# Altium schematic sheet DSO_CPLD.SchDoc
size A4
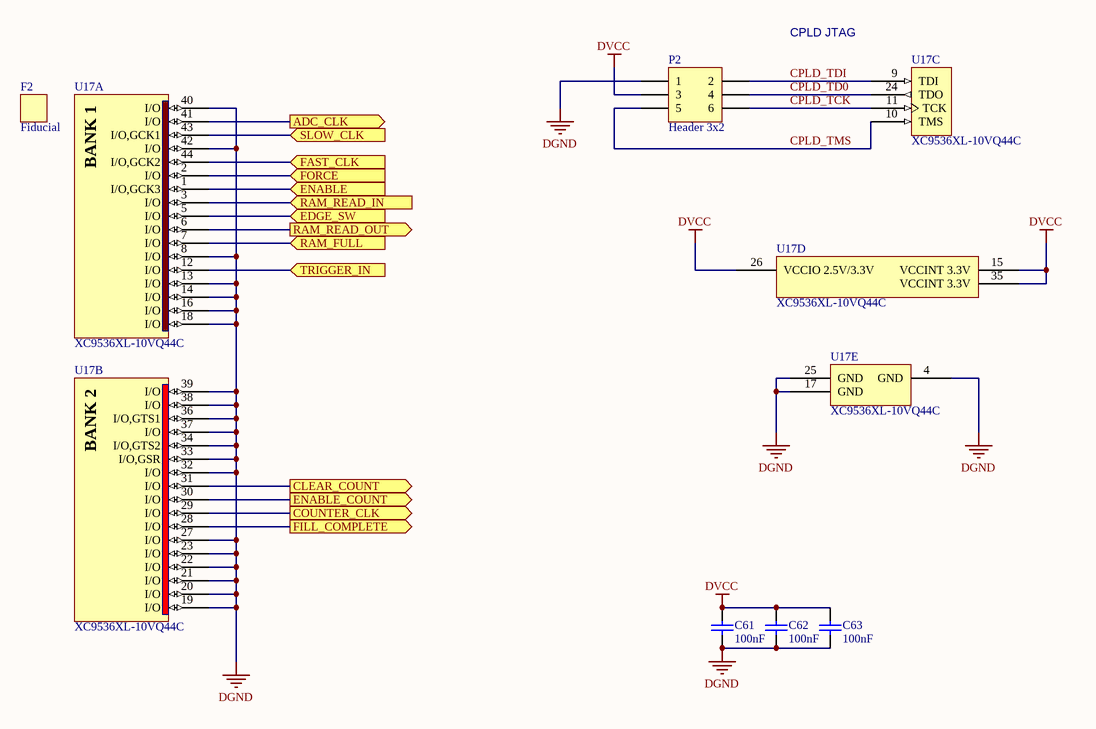
[diagram p0: DSO_CPLD.SchDoc]

## Parts
C61  100nF  [0805C]
C62  100nF  [0805C]
C63  100nF  [0805C]
F2  Fiducial  [FIDUCIAL]  (no BOM)
P2  Header 3x2  [HDR3x2]
U17  XC9536XL-10VQ44C  [VQ44_L]  (parts A,B,C,D,E of 5)

## Ports
ADC_CLK (out), CLEAR_COUNT (out), COUNTER_CLK (out), EDGE_SW (in), ENABLE (in), ENABLE_COUNT (out), FAST_CLK (in), FILL_COMPLETE (out), FORCE (in), RAM_FULL (in), RAM_READ_IN (in), RAM_READ_OUT (out), SLOW_CLK (in), TRIGGER_IN (in)

## Nets
DGND: C61.2 C62.2 C63.2 P2.1 U17.4(GND) U17.8(I/O) U17.13(I/O) U17.14(I/O) U17.16(I/O) U17.17(GND) U17.18(I/O) U17.19(I/O) U17.20(I/O) U17.21(I/O) U17.22(I/O) U17.23(I/O) U17.25(GND) U17.27(I/O) U17.32(I/O) U17.33(I/O,GSR) U17.34(I/O,GTS2) U17.36(I/O,GTS1) U17.37(I/O) U17.38(I/O) U17.39(I/O) U17.40(I/O) U17.42(I/O)
DVCC: C61.1 C62.1 C63.1 P2.3 U17.15(VCCINT_3.3V) U17.26(VCCIO_2.5V/3.3V) U17.35(VCCINT_3.3V)
ADC_CLK: U17.41(I/O) ; port ADC_CLK
CLEAR_COUNT: U17.31(I/O) ; port CLEAR_COUNT
COUNTER_CLK: U17.29(I/O) ; port COUNTER_CLK
CPLD_TCK: P2.6 U17.11(TCK)
CPLD_TD0: P2.4 U17.24(TDO)
CPLD_TDI: P2.2 U17.9(TDI)
CPLD_TMS: P2.5 U17.10(TMS)
EDGE_SW: U17.5(I/O) ; port EDGE_SW
ENABLE: U17.1(I/O,GCK3) ; port ENABLE
ENABLE_COUNT: U17.30(I/O) ; port ENABLE_COUNT
FAST_CLK: U17.44(I/O,GCK2) ; port FAST_CLK
FILL_COMPLETE: U17.28(I/O) ; port FILL_COMPLETE
FORCE: U17.2(I/O) ; port FORCE
RAM_FULL: U17.7(I/O) ; port RAM_FULL
RAM_READ_IN: U17.3(I/O) ; port RAM_READ_IN
RAM_READ_OUT: U17.6(I/O) ; port RAM_READ_OUT
SLOW_CLK: U17.43(I/O,GCK1) ; port SLOW_CLK
TRIGGER_IN: U17.12(I/O) ; port TRIGGER_IN

## Notes on the sheet
- CPLD JTAG
- (in symbol XC9536XL-10VQG44C, part A) BANK 1
- (in symbol XC9536XL-10VQG44C, part B) BANK 2

## Library data of the parts
C61-C63 = C: Capacitor; Reviewed by: RM - 2018/08/05; Revision: July-2002: Re-released for DXP Platform.; Value: 100nF; Supplier 1: *; Supplier Part Number 1: *
F2 = Fiducial: Fiducial for pick and place machine
P2 = Header 3x2: Header, 5-Pin; Reviewed by: RM - 2018/08/05; Supplier 1: Digi-Key; Supplier Part Number 1: 952-2121-ND
U17 = XC9536XL-10VQG44C: FastFLASH XC900XL, 3.3V High-Performance 36 Macrocell CPLD, 34 User I/Os, 44-Pin VQFP, Speed Grade 10, Commercial Grade; Reviewed by: RM - 2018/08/05; Supplier 1: Digi-Key; Supplier Part Number 1: 122-1385-ND